# Altium schematic sheet LCD.SchDoc: =VariantName
size 274 x 177 mm; SheetNumber: 5; SheetTotal: 7
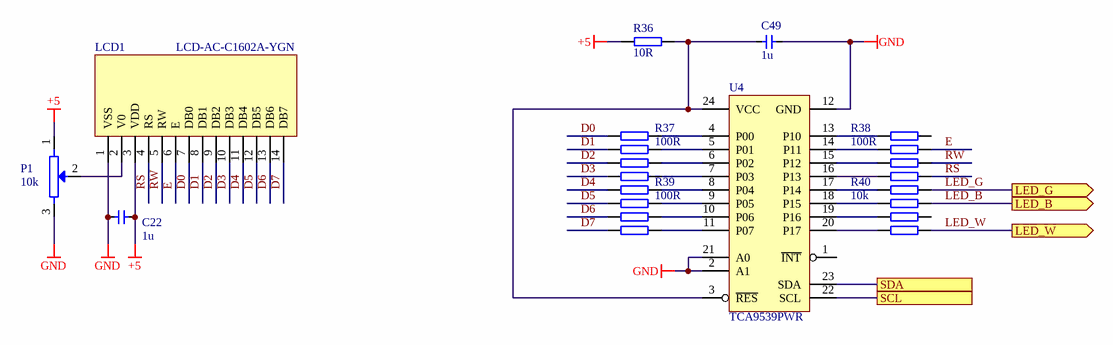
[diagram p0: LCD.SchDoc]

## Parts
C22  1u  [C0805]
C49  1u  [C0805]
LCD1  LCD-AC-C1602A-YGN  [LCD-AC-C1602A-YGN]
P1  10k  [POT67Y]
R36  10R  [R0805]
R37  100R  [YC164]
R38  100R  [YC164]
R39  100R  [YC164]
R40  10k  [YC164]
U4  TCA9539PWR  [PW_R-PDSO-G24]

## Ports
LED_B (out), LED_G (out), LED_W (out), SCL, SDA

## Nets
+5: C22.1 LCD1.3(VDD) P1.1 R36.2
GND: C22.2 C49.1 LCD1.1(VSS) P1.3 U4.2(A1) U4.12(GND) U4.21(A0)
D0: LCD1.7(DB0) R37.4
D1: LCD1.8(DB1) R37.3
D2: LCD1.9(DB2) R37.2
D3: LCD1.10(DB3) R37.1
D4: LCD1.11(DB4) R39.4
D5: LCD1.12(DB5) R39.3
D6: LCD1.13(DB6) R39.2
D7: LCD1.14(DB7) R39.1
E: LCD1.6(E) R38.6
LED_B: R40.6 ; port LED_B
LED_G: R40.5 ; port LED_G
LED_W: R40.8 ; port LED_W
RS: LCD1.4(RS) R38.8
RW: LCD1.5(RW) R38.7
SCL: U4.22(SCL) ; port SCL
SDA: U4.23(SDA) ; port SDA
NetC49_2: C49.2 R36.1 U4.3(~{RES}) U4.24(VCC)
NetLCD1_2: LCD1.2(V0) P1.2
NetR37_5: R37.5 U4.4(P00)
NetR37_6: R37.6 U4.5(P01)
NetR37_7: R37.7 U4.6(P02)
NetR37_8: R37.8 U4.7(P03)
NetR38_1: R38.1 U4.16(P13)
NetR38_2: R38.2 U4.15(P12)
NetR38_3: R38.3 U4.14(P11)
NetR38_4: R38.4 U4.13(P10)
NetR39_5: R39.5 U4.8(P04)
NetR39_6: R39.6 U4.9(P05)
NetR39_7: R39.7 U4.10(P06)
NetR39_8: R39.8 U4.11(P07)
NetR40_1: R40.1 U4.20(P17)
NetR40_2: R40.2 U4.19(P16)
NetR40_3: R40.3 U4.18(P15)
NetR40_4: R40.4 U4.17(P14)

Not connected (* = marked no-connect by the designer): R38 5; R40 7; U4 1(~{INT})

## Notes on the sheet
- Name:
- Device:
- File:

## Library data of the parts
C22 C49 = c: C; capacitor; Indeks: MKOS0603021; P&P: 1; Value: 1u
LCD1 = LCD-AC-C1602A-YGN: P&P: 0; Value: LCD-AC-C1602A-YGN; Indeks: *
P1 = POT67Y: R_P; P&P: 0; Value: 10k
R36 = R: R; resistor; Indeks: MRESR0603091; P&P: 1; Value: 10R
R37-R40 = YC164: R; Drabinka rezystorowa; Indeks: MRESD4D03003; P&P: 1
  R37-R39: Value: 100R
  R40: Value: 10k
U4 = TCA9539PWR: I2C 16-BIT port; Indeks: MUKSC382; P&P: 1; Value: TCA9539PWR